# EasyEDA Pro project ProPrj_digirig-mobile_2025-02-21.epro

# Schematic digirig-mobile
Board Name: digirig-mobile; Create Date: 2025-02-21; Page Name: digirig-mobile; Project Name: digirig-mobile; Schematic Name: digirig-mobile; Update Date: 2025-02-20; File: digirig-mobile; Id: /; Sheet: /
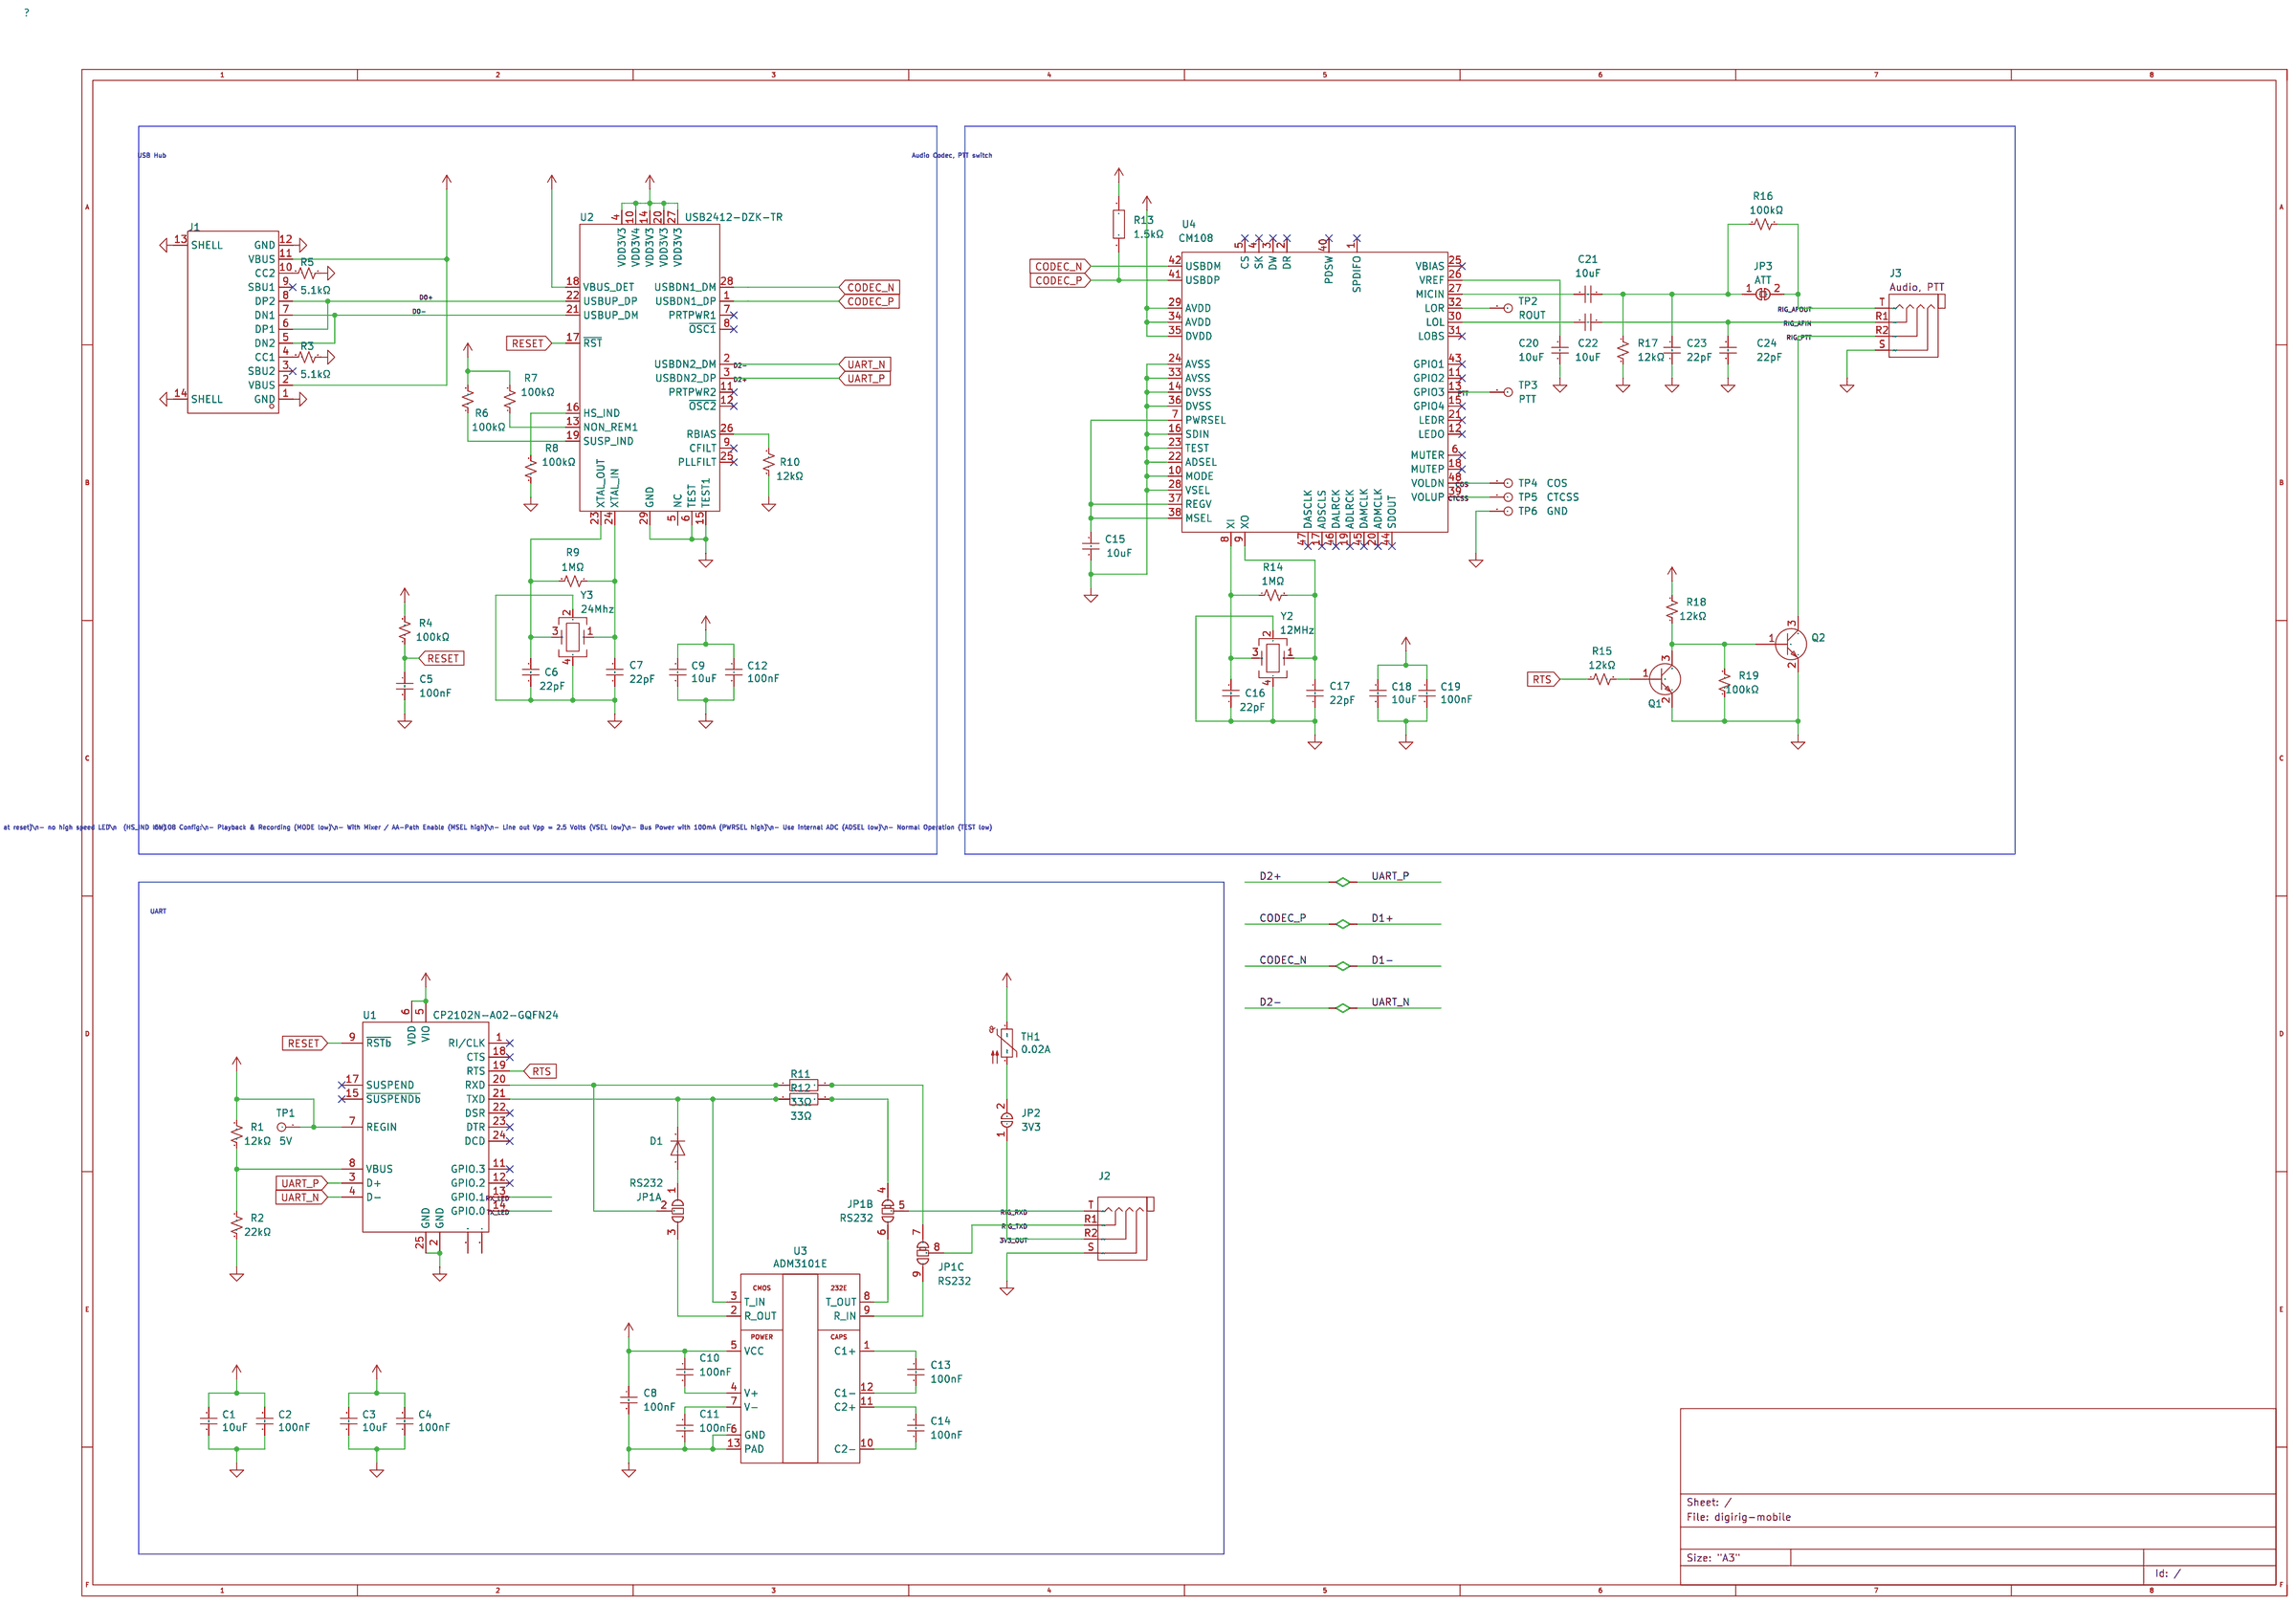
[diagram p0: schematic sheet]

## Parts
C1  10uF  [C0402]
C2  100nF  [C0402]
C3  10uF  [C0402]
C4  100nF  [C0402]
C5  100nF  [C0402]
C6  22pF  [C0402]
C7  22pF  [C0402]
C8  100nF  [C0402]
C9  10uF  [C0402]
C10  100nF  [C0402]
C11  100nF  [C0402]
C12  100nF  [C0402]
C13  100nF  [C0402]
C14  100nF  [C0402]
C15  10uF  [C0402]
C16  22pF  [C0402]
C17  22pF  [C0402]
C18  10uF  [C0402]
C19  100nF  [C0402]
C20  10uF  [C0402]
C21  10uF  [C0402]
C22  10uF  [C0402]
C23  22pF  [C0402]
C24  22pF  [C0402]
D1  1N5819WS  [SOD-323_L1.8-W1.3-LS2.5-RD]
J1  TYPE-C 16PIN 2MD(073)  [USB-C-SMD_TYPE-C-6PIN-2MD-073]
J2  PJ-320A  [footprints:TRRS-PJ-320A]
J3  PJ-320A  [footprints:TRRS-PJ-320A]
JP1  RS232  [footprints:SolderJumper9-BCu]  (sections 1,2,3)
JP2  3V3  [footprints:SolderJumper2-BCu]
JP3  ATT  [footprints:SolderJumper-BCu-Bridged]
Q1  SS8050  [SOT-23-3_L2.9-W1.3-P1.90-LS2.4-BR]
Q2  SS8050  [SOT-23-3_L2.9-W1.3-P1.90-LS2.4-BR]
R1  12kΩ  [R0402]
R2  22kΩ  [R0402]
R3  5.1kΩ  [R0402]
R4  100kΩ  [R0402]
R5  5.1kΩ  [R0402]
R6  100kΩ  [R0402]
R7  100kΩ  [R0402]
R8  100kΩ  [R0402]
R9  1MΩ  [R0402]
R10  12kΩ  [R0402]
R11  33Ω  [R0402]
R12  33Ω  [R0402]
R13  1.5kΩ  [R0402]
R14  1MΩ  [R0402]
R15  12kΩ  [R0402]
R16  100kΩ  [R0402]
R17  12kΩ  [R0402]
R18  12kΩ  [R0402]
R19  100kΩ  [R0402]
TH1  0.02A  [Resistor_SMD:R_0603_1608Metric]
TP1  5V  [footprints:TP]
TP2  ROUT  [footprints:TP]
TP3  PTT  [footprints:TP]
TP4  COS  [footprints:TP]
TP5  CTCSS  [footprints:TP]
TP6  GND  [footprints:TP]
U1  CP2102N-A02-GQFN24  [Package_DFN_QFN:QFN-24-1EP_4x4mm_P0.5mm_EP2.6x2.6mm]
U2  USB2412-DZK-TR  [Package_DFN_QFN:QFN-28-1EP_5x5mm_P0.5mm_EP3.35x3.35mm]
U3  ADM3101E  [Package_DFN_QFN:QFN-12-1EP_3x3mm_P0.51mm_EP1.45x1.45mm]
U4  CM108  [Package_QFP:LQFP-48_7x7mm_P0.5mm]
Y2  12MHz  [CRYSTAL-SMD_4P-L3.2-W2.5-BL]
Y3  24Mhz  [CRYSTAL-SMD_4P-L3.2-W2.5-BL]

## Library data of the parts
C1 C3 C9 C15 C18 C20-C22 = CL05A106MQ5NUNC: 容值:10uF;精度:±20%;额定电压:6.3V;材质(温度系数):X5R;; LCSC Part Name: 10uF ±20% 6.3V; Supplier Part: C15525; Manufacturer: SAMSUNG(三星); Supplier Footprint: 0402; JLCPCB Part Class: Basic Part; Datasheet: https://atta.szlcsc.com/upload/public/pdf/source/20220823/2B02EE04F8F211D38A52DCB16EB6BEBA.pdf; Supplier: LCSC; Tolerance: ±20%; Voltage Rated: 6.3V; Temperature Coefficient: X5R
C2 C4 C5 C8 C10-C14 C19 = CL05B104KB54PNC: 容值:100nF;精度:±10%;额定电压:50V;材质(温度系数):X7R;; LCSC Part Name: 100nF ±10% 50V; Supplier Part: C307331; Manufacturer: SAMSUNG(三星); Supplier Footprint: 0402; JLCPCB Part Class: Basic Part; Datasheet: https://atta.szlcsc.com/upload/public/pdf/source/20160218/1457707763339.pdf; Supplier: LCSC; Tolerance: ±10%; Voltage Rated: 50V; Temperature Coefficient: X7R
C6 C7 C16 C17 C23 C24 = 0402CG220J500NT: 容值:22pF;精度:±5%;额定电压:50V;材质(温度系数):C0G;; LCSC Part Name: 22pF ±5% 50V; Supplier Part: C1555; Manufacturer: FH(风华); Supplier Footprint: 0402; JLCPCB Part Class: Basic Part; Datasheet: https://atta.szlcsc.com/upload/public/pdf/source/20200305/C486355_26A10D38EF8C2A5C37091D0039909270.pdf; Supplier: LCSC; Tolerance: ±5%; Voltage Rated: 50V; Temperature Coefficient: C0G
D1 = 1N5819WS_C191023: 正向压降(Vf):600mV@1A;直流反向耐压(Vr):40V;整流电流:1A;; LCSC Part Name: 电压:40V 电流:1A; Supplier Part: C191023; Manufacturer: Hottech(合科泰); Supplier Footprint: SOD-323; JLCPCB Part Class: Basic Part; Datasheet: https://atta.szlcsc.com/upload/public/pdf/source/20220428/3CB86FD8D28D653594B4E35F9D5AEFD9.pdf; Supplier: LCSC; Forward Voltage (Vf@If): 600mV@1A; Reverse Voltage (Vr): 40V; Rectified Current: 1A
J1 = TYPE-C 16PIN 2MD(073): 连接器类型:Type-C;标准:USB 3.1;公母:母;安装方式:卧贴;触点数量:16P;端口数量:1;额定电流 - 电源:5A;工作温度范围:-25℃~+85℃;; LCSC Part Name: Type-C 母 卧贴; Supplier Part: C2765186; Manufacturer: SHOU HAN(首韩); Supplier Footprint: SMD; JLCPCB Part Class: Extended Part; Datasheet: https://atta.szlcsc.com/upload/public/pdf/source/20211123/39B17C16241EAC15C5E277BDA434118E.pdf; Supplier: LCSC; Connector Type: Type-C; Standard: USB 3.1; Gender: 母; Mounting Style: 卧贴; Number of Contacts: 16P; Number of Ports: 1; Current Rating - Power (Max): 5A; Operating Temperature Range: -25℃~+85℃; Rated Voltage (Max): 5V; Connect-Disconnect Life: 5千次; Core Colour: 黑色
J2 = Connector_AudioJack4: Label: Serial, 3V3
J3 = Connector_AudioJack4: Label: Audio, PTT
JP1 = digirig_SolderJumper_9
JP2 = Jumper_SolderJumper_2_Open
JP3 = Jumper_SolderJumper_2_Bridged
Q1 Q2 = SS8050_C7420370: 晶体管类型:NPN;集电极电流(Ic):1.5A;集射极击穿电压(Vceo):25V;功率(Pd):300mW;直流电流增益(hFE@Ic,Vce):120@100mA,1.0V;; LCSC Part Name: 耐压:25V 电流:1.5A NPN H档 200-350; Supplier Part: C7420370; Manufacturer: 宏迦橙; Supplier Footprint: SOT-23; JLCPCB Part Class: Extended Part; Datasheet: https://atta.szlcsc.com/upload/public/pdf/source/20231222/9C4050A7669EB24B3ACD0418218817FD.pdf; Supplier: LCSC; Transistor Type: NPN; Collector Current (Ic): 1.5A; Collector-Emitter Breakdown Voltage (Vceo): 25V; Power Dissipation (Pd): 300mW; DC Current Gain (hFE@Ic,Vce): 120@100mA,1.0V; Transition Frequency (fT): 100MHz; Collector Cut-Off Current (Icbo): 100nA; Collector-Emitter Saturation Voltage (VCE(sat)@Ic,Ib): 500mV@800mA,80mA; Operating Temperature: -55℃~+150℃
R1 R10 R15 R17 R18 = 0402WGF1202TCE: 电阻类型:厚膜电阻;阻值:12kΩ;精度:±1%;功率:62.5mW;最大工作电压:50V;温度系数:±100ppm/℃;; LCSC Part Name: 12kΩ ±1% 62.5mW 厚膜电阻; Supplier Part: C25752; Manufacturer: UNI-ROYAL(厚声); Supplier Footprint: 0402; JLCPCB Part Class: Basic Part; Datasheet: https://atta.szlcsc.com/upload/public/pdf/source/20200306/C422600_1E6D84923E4A46A82E41ADD87F860B5C.pdf; Supplier: LCSC; Type: 厚膜电阻; Tolerance: ±1%; Power(Watts): 62.5mW; Overload Voltage (Max): 50V; Temperature Coefficient: ±100ppm/℃; Operating Temperature Range: -55℃~+155℃
R2 = 0402WGF2202TCE: 电阻类型:厚膜电阻;阻值:22kΩ;精度:±1%;功率:62.5mW;最大工作电压:50V;温度系数:±100ppm/℃;; LCSC Part Name: 22kΩ ±1% 62.5mW 厚膜电阻; Supplier Part: C25768; Manufacturer: UNI-ROYAL(厚声); Supplier Footprint: 0402; JLCPCB Part Class: Basic Part; Datasheet: https://atta.szlcsc.com/upload/public/pdf/source/20200306/C422600_1E6D84923E4A46A82E41ADD87F860B5C.pdf; Supplier: LCSC; Type: 厚膜电阻; Tolerance: ±1%; Power(Watts): 62.5mW; Overload Voltage (Max): 50V; Temperature Coefficient: ±100ppm/℃; Operating Temperature Range: -55℃~+155℃
R3 R5 = 0402WGF5101TCE: 电阻类型:厚膜电阻;阻值:5.1kΩ;精度:±1%;功率:62.5mW;最大工作电压:50V;温度系数:±100ppm/℃;; LCSC Part Name: 5.1kΩ ±1% 62.5mW 厚膜电阻; Supplier Part: C25905; Manufacturer: UNI-ROYAL(厚声); Supplier Footprint: 0402; JLCPCB Part Class: Basic Part; Datasheet: https://atta.szlcsc.com/upload/public/pdf/source/20200306/C422600_1E6D84923E4A46A82E41ADD87F860B5C.pdf; Supplier: LCSC; Type: 厚膜电阻; Tolerance: ±1%; Power(Watts): 62.5mW; Overload Voltage (Max): 50V; Temperature Coefficient: ±100ppm/℃; Operating Temperature Range: -55℃~+155℃
R4 R6-R8 R16 R19 = 0402WGF1003TCE: 电阻类型:厚膜电阻;阻值:100kΩ;精度:±1%;功率:62.5mW;最大工作电压:50V;温度系数:±100ppm/℃;; LCSC Part Name: 100kΩ ±1% 62.5mW 厚膜电阻; Supplier Part: C25741; Manufacturer: UNI-ROYAL(厚声); Supplier Footprint: 0402; JLCPCB Part Class: Basic Part; Datasheet: https://atta.szlcsc.com/upload/public/pdf/source/20200306/C422600_1E6D84923E4A46A82E41ADD87F860B5C.pdf; Supplier: LCSC; Type: 厚膜电阻; Tolerance: ±1%; Power(Watts): 62.5mW; Overload Voltage (Max): 50V; Temperature Coefficient: ±100ppm/℃; Operating Temperature Range: -55℃~+155℃
R9 R14 = 0402WGF1004TCE: 电阻类型:厚膜电阻;阻值:1MΩ;精度:±1%;功率:62.5mW;最大工作电压:50V;温度系数:±100ppm/℃;; LCSC Part Name: 1MΩ ±1% 62.5mW 厚膜电阻; Supplier Part: C26083; Manufacturer: UNI-ROYAL(厚声); Supplier Footprint: 0402; JLCPCB Part Class: Basic Part; Datasheet: https://atta.szlcsc.com/upload/public/pdf/source/20200306/C422600_1E6D84923E4A46A82E41ADD87F860B5C.pdf; Supplier: LCSC; Type: 厚膜电阻; Tolerance: ±1%; Power(Watts): 62.5mW; Overload Voltage (Max): 50V; Temperature Coefficient: ±100ppm/℃; Operating Temperature Range: -55℃~+155℃
R11 R12 = 0402WGF330JTCE: 电阻类型:厚膜电阻;阻值:33Ω;精度:±1%;功率:62.5mW;最大工作电压:50V;温度系数:±100ppm/℃;; LCSC Part Name: 33Ω ±1% 62.5mW 厚膜电阻; Supplier Part: C25105; Manufacturer: UNI-ROYAL(厚声); Supplier Footprint: 0402; JLCPCB Part Class: Basic Part; Datasheet: https://atta.szlcsc.com/upload/public/pdf/source/20200306/C422600_1E6D84923E4A46A82E41ADD87F860B5C.pdf; Supplier: LCSC; Type: 厚膜电阻; Tolerance: ±1%; Power(Watts): 62.5mW; Overload Voltage (Max): 50V; Temperature Coefficient: ±100ppm/℃; Operating Temperature Range: -55℃~+155℃
R13 = 0402WGF1501TCE: 电阻类型:厚膜电阻;阻值:1.5kΩ;精度:±1%;功率:62.5mW;最大工作电压:50V;温度系数:±100ppm/℃;; LCSC Part Name: 1.5kΩ ±1% 62.5mW 厚膜电阻; Supplier Part: C25867; Manufacturer: UNI-ROYAL(厚声); Supplier Footprint: 0402; JLCPCB Part Class: Basic Part; Datasheet: https://atta.szlcsc.com/upload/public/pdf/source/20200306/C422600_1E6D84923E4A46A82E41ADD87F860B5C.pdf; Supplier: LCSC; Type: 厚膜电阻; Tolerance: ±1%; Power(Watts): 62.5mW; Overload Voltage (Max): 50V; Temperature Coefficient: ±100ppm/℃; Operating Temperature Range: -55℃~+155℃
TH1 = Device_Thermistor_PTC
TP1-TP6 = Connector_TestPoint
U1 = Interface_USB_CP2102N-A01-GQFN24: User doc link: https://www.silabs.com/documents/public/data-sheets/cp2102n-datasheet.pdf
U2 = digirig_USB2412-DZK-TR
U3 = digirig_ADM3101E
U4 = digirig_CM108
Y2 Y3 = X322512MSB4SI: 晶振类型:贴片晶振;频率:12MHz;常温频差:±10ppm;外接负载电容:20pF;频率稳定度(全温):±20ppm;; LCSC Part Name: 12MHz ±10ppm 20pF; Supplier Part: C9002; Manufacturer: YXC(扬兴晶振); Supplier Footprint: SMD3225-4P; JLCPCB Part Class: Basic Part; Datasheet: https://atta.szlcsc.com/upload/public/pdf/source/20240329/19D5F850207469550BEB00D7DFEDBC7A.pdf; Supplier: LCSC; Crystal Type: 贴片晶振; Normal temperature Frequency Tolerance: ±10ppm; External load capacitor: 20pF; Frequency Stability(Full temperature range): ±20ppm; Operating Temperature: -40℃~+85℃

## Nets
3V3_OUT: J2.R2 JP2.1(A)
CODEC_N: U2.28(USBDN1_DM) U4.42(USBDM)
CODEC_P: R13.2 U2.1(USBDN1_DP) U4.41(USBDP)
COS: TP4.1 U4.48(VOLDN)
CTCSS: TP5.1 U4.39(VOLUP)
D0+: J1.6(DP1) J1.8(DP2) U2.22(USBUP_DP)
D0-: J1.5(DN2) J1.7(DN1) U2.21(USBUP_DM)
D2+: U1.3(D+) U2.3(USBDN2_DP)
D2-: U1.4(D-) U2.2(USBDN2_DM)
POWER_+3V3: C3.1 C4.1 C8.1 C9.1 C10.1 C12.1 R4.2 R6.2 R7.2 R13.1 TH1.1 U1.5(VIO) U1.6(VDD) U2.4(VDD3V3) U2.10(VDD3V4) U2.14(VDD3V3) U2.18(VBUS_DET) U2.20(VDD3V3) U2.27(VDD3V3) U3.5(VCC)
POWER_+5V: C1.1 C2.1 C18.1 C19.1 J1.2(VBUS) J1.11(VBUS) R1.2 R18.2 TP1.1 U1.7(REGIN) U4.29(AVDD) U4.34(AVDD) U4.35(DVDD)
POWER_GND: C1.2 C2.2 C3.2 C4.2 C5.2 C6.2 C7.2 C8.2 C9.2 C11.2 C12.2 C15.1 C16.2 C17.2 C18.2 C19.2 C20.2 C23.2 C24.2 J1.1(GND) J1.12(GND) J1.13(SHELL) J1.14(SHELL) J2.S J3.S Q1.2(E) Q2.2(E) R2.1 R3.1 R5.1 R8.1 R10.1 R17.2 R19.1 TP6.1 U1.2(GND) U1.25(GND) U2.6(TEST) U2.15(TEST1) U2.29(GND) U3.6(GND) U3.13(PAD) U4.10(MODE) U4.14(DVSS) U4.16(SDIN) U4.22(ADSEL) U4.23(TEST) U4.24(AVSS) U4.28(VSEL) U4.33(AVSS) U4.36(DVSS) Y2.2 Y2.4 Y3.2 Y3.4
PTT: TP3.1 U4.13(GPIO3)
RESET: C5.1 R4.1 U1.9(~{RSTb}) U2.17(~{RST})
RIG_AFIN: C22.1 C24.1 J3.R1
RIG_AFOUT: J3.T JP3.2(B) R16.1
RIG_PTT: J3.R2 Q2.3(C)
RIG_RXD: J2.T JP1.5(B)
RIG_TXD: J2.R1 JP1.8(B)
RTS: R15.1 U1.19(RTS)
RX_LED: U1.13(GPIO.1)
TX_LED: U1.14(GPIO.0)
$1N2: R1.1 R2.2 U1.8(VBUS)
$1N10: C14.1 U3.11(C2+)
$1N15: C20.1 U4.26(VREF)
$1N17: JP1.6(C) U3.8(T_OUT)
$1N18: R7.1 U2.13(NON_REM1)
$1N19: C16.1 R14.1 U4.8(XI) Y2.3
$1N20: C17.1 R14.2 U4.9(XO) Y2.1
$1N22: JP1.4(A) R12.2
$1N28: JP1.9(C) U3.9(R_IN)
$1N35: C6.1 R9.2 U2.23(XTAL_OUT) Y3.3
$1N36: C21.1 C23.1 JP3.1(A) R16.2 R17.1
$1N41: JP1.2(B) R11.1 U1.20(RXD)
$1N46: C13.1 U3.1(C1+)
$1N47: Q1.3(C) Q2.1(B) R18.1 R19.2
$1N49: D1.1(K) R12.1 U1.21(TXD) U3.3(T_IN)
$1N52: C13.2 U3.12(C1-)
$1N53: C21.2 U4.27(MICIN)
$1N55: C7.1 R9.1 U2.24(XTAL_IN) Y3.1
$1N61: C22.2 U4.30(LOL)
$1N63: JP2.2(B) TH1.2
$1N69: D1.2(A) JP1.1(A)
$1N71: C11.1 U3.7(V-)
$1N73: C15.2 U4.7(PWRSEL) U4.37(REGV) U4.38(MSEL)
$1N87: JP1.3(C) U3.2(R_OUT)
$1N90: C10.2 U3.4(V+)
$1N97: R8.2 U2.16(HS_IND)
$1N110: R10.2 U2.26(RBIAS)
$1N111: TP2.1 U4.32(LOR)
$1N114: JP1.7(A) R11.2
$1N116: C14.2 U3.10(C2-)
$1N122: R6.1 U2.19(SUSP_IND)
$1N130: Q1.1(B) R15.2
$1N5736: J1.10(CC2) R5.2
$1N5738: J1.4(CC1) R3.2

Not connected (* = marked no-connect by the designer): J1 3(SBU2)* 9(SBU1)*; U1 1(RI/CLK)* 10(NC) 11(GPIO.3)* 12(GPIO.2)* 15(~{SUSPENDb})* 16(NC) 17(SUSPEND)* 18(CTS)* 22(DSR)* 23(DTR)* 24(DCD)*; U2 5(NC) 7(PRTPWR1)* 8(~{OSC1})* 9(CFILT)* 11(PRTPWR2)* 12(~{OSC2})* 25(PLLFILT)*; U4 1(SPDIFO)* 2(DR)* 3(DW)* 4(SK)* 5(CS)* 6(MUTER)* 11(GPIO2)* 12(LEDO)* 15(GPIO4)* 17(ADSCLS)* 18(MUTEP)* 19(ADLRCK)* 20(ADMCLK)* 21(LEDR)* 25(VBIAS)* 31(LOBS)* 40(PDSW)* 43(GPIO1)* 44(SDOUT)* 45(DAMCLK)* 46(DALRCK)* 47(DASCLK)*

## Notes on the sheet
- USB Hub
- Audio Codec, PTT switch
- USB1412 Config:\n- both ports are non-removable\n  (NON_REM1, SUSP_IND/NON_REM2 high at reset)\n- no high speed LED\n  (HS_IND low)
- CM108 Config:\n- Playback & Recording (MODE low)\n- With Mixer / AA-Path Enable (MSEL high)\n- Line out Vpp = 2.5 Volts (VSEL low)\n- Bus Power with 100mA (PWRSEL high)\n- Use internal ADC (ADSEL low)\n- Normal Operation (TEST low)
- UART

# Board digirig-mobile
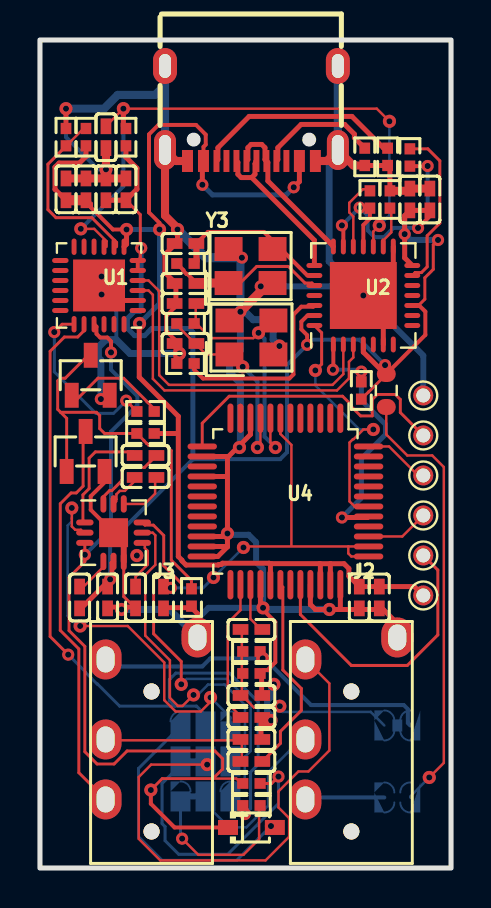
[diagram p1: board, top side]
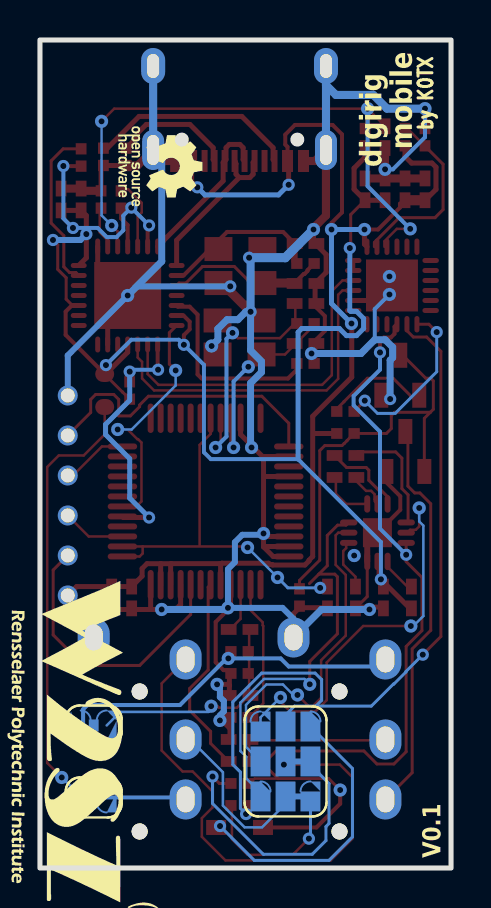
[diagram p2: board, bottom side, seen from below]

Outline 20.57 x 41.4 mm; copper layers: Top Layer, Bottom Layer. Coordinates in mm from the lower left corner of the outline.
Outline path: rectangle 0,41.4 20.57,0
Stack: Top Layer 0.0009mm / dielectric 1 0.0384mm FR4 er 4.5 / Bottom Layer 0.0009mm

## Design rules (mm)
spacing safeClearance (default): track to track 0.152, other pairs 0.152 to 0.3
track width trackWidth (default): min 0.127, default 0.254, max 2.54
differential pair differentialPair (default): width min 0.127, default 0.254, max 2.54; gap min 0.152, default 0.152
via viaSize (default): diameter min 0.5, default 0.61, max 10; hole min 0.3, default 0.305, max 6

## Placement (name value [footprint] x y rotation side)
C1  10uF  [C0402]  1.3 33.94 90 top
C2  100nF  [C0402]  2.3 33.94 90 top
C3  10uF  [C0402]  19.51 33.43 90 top
C4  100nF  [C0402]  18.51 33.43 90 top
C5  100nF  [C0402]  3.3 36.54 270 top
C6  22pF  [C0402]  7.28 31.23 180 top
C7  22pF  [C0402]  7.28 29.23 180 top
C8  100nF  [C0402]  3.38 13.53 270 top
C9  10uF  [C0402]  4.3 33.94 90 top
C10  100nF  [C0402]  1.98 13.53 90 top
C11  100nF  [C0402]  4.78 13.53 270 top
C12  100nF  [C0402]  3.3 33.94 90 top
C13  100nF  [C0402]  5.28 20.63 0 top
C14  100nF  [C0402]  5.28 19.53 0 top
C15  10uF  [C0402]  6.18 13.53 90 top
C16  22pF  [C0402]  7.28 28.23 180 top
C17  22pF  [C0402]  7.28 26.23 180 top
C18  10uF  [C0402]  15.98 13.53 270 top
C19  100nF  [C0402]  16.98 13.53 270 top
C20  10uF  [C0402]  10.58 7.53 0 top
C21  10uF  [C0402]  10.58 11.93 0 top
C22  10uF  [C0402]  10.58 5.33 0 top
C23  22pF  [C0402]  10.58 8.63 0 top
C24  22pF  [C0402]  10.58 6.43 0 top
D1  1N5819WS  [SOD-323_L1.8-W1.3-LS2.5-RD]  10.58 2.03 0 top
J1  TYPE-C 16PIN 2MD(073)  [USB-C-SMD_TYPE-C-6PIN-2MD-073]  10.58 37.73 180 top
J2  PJ-320A  [footprints:TRRS-PJ-320A]  15.58 0.23 180 top
J3  PJ-320A  [footprints:TRRS-PJ-320A]  5.58 0.23 180 top
JP1  RS232  [footprints:SolderJumper9-BCu]  8.28 5.33 180 bottom
JP2  3V3  [footprints:SolderJumper2-BCu]  17.88 3.53 180 bottom
JP3  ATT  [footprints:SolderJumper-BCu-Bridged]  17.88 7.13 180 bottom
Q1  SS8050  [SOT-23-3_L2.9-W1.3-P1.90-LS2.4-BR]  2.54 24.64 270 top
Q2  SS8050  [SOT-23-3_L2.9-W1.3-P1.90-LS2.4-BR]  2.29 20.83 270 top
R1  12kΩ  [R0402]  2.3 36.54 270 top
R2  22kΩ  [R0402]  1.3 36.54 270 top
R3  5.1kΩ  [R0402]  16.26 35.56 90 top
R4  100kΩ  [R0402]  4.3 36.54 270 top
R5  5.1kΩ  [R0402]  17.4 35.56 90 top
R6  100kΩ  [R0402]  16.51 33.43 270 top
R7  100kΩ  [R0402]  18.51 35.53 270 top
R8  100kΩ  [R0402]  17.51 33.43 270 top
R9  1MΩ  [R0402]  7.28 30.23 0 top
R10  12kΩ  [R0402]  7.28 25.23 0 top
R11  33Ω  [R0402]  10.58 3.13 0 top
R12  33Ω  [R0402]  10.58 4.23 0 top
R13  1.5kΩ  [R0402]  16.08 23.88 90 top
R14  1MΩ  [R0402]  7.28 27.23 180 top
R15  12kΩ  [R0402]  5.28 22.83 0 top
R16  100kΩ  [R0402]  10.58 10.83 180 top
R17  12kΩ  [R0402]  10.58 9.73 0 top
R18  12kΩ  [R0402]  5.28 21.73 0 top
R19  100kΩ  [R0402]  7.58 13.53 90 top
TH1  0.02A  [Resistor_SMD:R_0603_1608Metric]  17.33 23.88 270 top
TP1  5V  [footprints:TP]  19.18 13.63 0 top
TP2  ROUT  [footprints:TP]  19.18 15.63 0 top
TP3  PTT  [footprints:TP]  19.18 21.63 0 top
TP4  COS  [footprints:TP]  19.18 19.63 0 top
TP5  CTCSS  [footprints:TP]  19.18 17.63 0 top
TP6  GND  [footprints:TP]  19.18 23.63 0 top
U1  CP2102N-A02-GQFN24  [Package_DFN_QFN:QFN-24-1EP_4x4mm_P0.5mm_EP2.6x2.6mm]  2.96 29.13 180 top
U2  USB2412-DZK-TR  [Package_DFN_QFN:QFN-28-1EP_5x5mm_P0.5mm_EP3.35x3.35mm]  16.18 28.63 90 top
U3  ADM3101E  [Package_DFN_QFN:QFN-12-1EP_3x3mm_P0.51mm_EP1.45x1.45mm]  3.68 16.77 0 top
U4  CM108  [Package_QFP:LQFP-48_7x7mm_P0.5mm]  12.28 18.33 270 top
Y2  12MHz  [CRYSTAL-SMD_4P-L3.2-W2.5-BL]  10.58 26.53 0 top
Y3  24Mhz  [CRYSTAL-SMD_4P-L3.2-W2.5-BL]  10.54 30.1 0 top

## Footprints (pads in the part's own frame, mm; a bottom-side part is the same pattern mirrored in y, then rotated)
C0402
  rect 0.79x0.54 smd: 1(-0.545,0) 2(0.545,0)
CRYSTAL-SMD_4P-L3.2-W2.5-BL
  rect 1.4x1.2 smd: 1(-1.1,-0.85) 2(1.1,-0.85) 3(1.1,0.85) 4(-1.1,0.85)
footprints:SolderJumper2-BCu
  custom 1x1.5 smd: 1(0.65,0) 2(-0.65,0)
footprints:SolderJumper9-BCu
  custom 1x1.5 smd: 1(1.25,1.75) 3(-1.25,1.75) 7(1.25,-1.75) 9(-1.25,-1.75)
  rect 1x1.5 smd: 2(0,1.75) 4(1.25,0) 5(0,0) 6(-1.25,0) 8(0,-1.75)
footprints:SolderJumper-BCu-Bridged
  custom 1x1.5 smd: 1(0.65,0) 2(-0.65,0)
footprints:TP
  round 1 hole 0.7: 1(0,0)
footprints:TRRS-PJ-320A
  round 0.8 hole 0.8: (0,-1.6) (0,-8.6)
  oval 1.6x2 hole 0.9x1.3: R1(2.3,-6.2) R2(2.3,-3.2) S(-2.3,-11.3) T(2.3,-10.2)
Package_DFN_QFN:QFN-12-1EP_3x3mm_P0.51mm_EP1.45x1.45mm
  rrect 0.875x0.3 smd: 1(-1.438,0.51) 2(-1.438,0) 3(-1.438,-0.51) 7(1.438,-0.51) 8(1.438,0) 9(1.438,0.51)
  rrect 0.3x0.875 smd: 4(-0.51,-1.438) 5(0,-1.438) 6(0.51,-1.438) 10(0.51,1.438) 11(0,1.438) 12(-0.51,1.438)
  rect 1.45x1.45 smd: 13(0,0)
Package_DFN_QFN:QFN-24-1EP_4x4mm_P0.5mm_EP2.6x2.6mm
  rrect 0.825x0.25 smd: 1(-1.938,1.25) 2(-1.938,0.75) 3(-1.938,0.25) 4(-1.938,-0.25) 5(-1.938,-0.75) 6(-1.938,-1.25) 13(1.938,-1.25) 14(1.938,-0.75) 15(1.938,-0.25) 16(1.938,0.25) 17(1.938,0.75) 18(1.938,1.25)
  rrect 0.25x0.825 smd: 7(-1.25,-1.938) 8(-0.75,-1.938) 9(-0.25,-1.938) 10(0.25,-1.938) 11(0.75,-1.938) 12(1.25,-1.938) 19(1.25,1.938) 20(0.75,1.938) 21(0.25,1.938) 22(-0.25,1.938) 23(-0.75,1.938) 24(-1.25,1.938)
  rect 2.6x2.6 smd: 25(0,0)
Package_DFN_QFN:QFN-28-1EP_5x5mm_P0.5mm_EP3.35x3.35mm
  rrect 0.8x0.25 smd: 1(-2.45,1.5) 2(-2.45,1) 3(-2.45,0.5) 4(-2.45,0) 5(-2.45,-0.5) 6(-2.45,-1) 7(-2.45,-1.5) 15(2.45,-1.5) 16(2.45,-1) 17(2.45,-0.5) 18(2.45,0) 19(2.45,0.5) 20(2.45,1) 21(2.45,1.5)
  rrect 0.25x0.8 smd: 8(-1.5,-2.45) 9(-1,-2.45) 10(-0.5,-2.45) 11(0,-2.45) 12(0.5,-2.45) 13(1,-2.45) 14(1.5,-2.45) 22(1.5,2.45) 23(1,2.45) 24(0.5,2.45) 25(0,2.45) 26(-0.5,2.45) 27(-1,2.45) 28(-1.5,2.45)
  rect 3.35x3.35 smd: 29(0,0)
Package_QFP:LQFP-48_7x7mm_P0.5mm
  rrect 1.475x0.3 smd: 1(-4.162,2.75) 2(-4.162,2.25) 3(-4.162,1.75) 4(-4.162,1.25) 5(-4.162,0.75) 6(-4.162,0.25) 7(-4.162,-0.25) 8(-4.162,-0.75) 9(-4.162,-1.25) 10(-4.162,-1.75) 11(-4.162,-2.25) 12(-4.162,-2.75) 25(4.162,-2.75) 26(4.162,-2.25) 27(4.162,-1.75) 28(4.162,-1.25) 29(4.162,-0.75) 30(4.162,-0.25) 31(4.162,0.25) 32(4.162,0.75) 33(4.162,1.25) 34(4.162,1.75) 35(4.162,2.25) 36(4.162,2.75)
  rrect 0.3x1.475 smd: 13(-2.75,-4.162) 14(-2.25,-4.162) 15(-1.75,-4.162) 16(-1.25,-4.162) 17(-0.75,-4.162) 18(-0.25,-4.162) 19(0.25,-4.162) 20(0.75,-4.162) 21(1.25,-4.162) 22(1.75,-4.162) 23(2.25,-4.162) 24(2.75,-4.162) 37(2.75,4.162) 38(2.25,4.162) 39(1.75,4.162) 40(1.25,4.162) 41(0.75,4.162) 42(0.25,4.162) 43(-0.25,4.162) 44(-0.75,4.162) 45(-1.25,4.162) 46(-1.75,4.162) 47(-2.25,4.162) 48(-2.75,4.162)
R0402
  rect 0.566x0.54 smd: 1(-0.433,0) 2(0.433,0)
Resistor_SMD:R_0603_1608Metric
  rrect 0.8x0.95 smd: 1(-0.825,0) 2(0.825,0)
SOD-323_L1.8-W1.3-LS2.5-RD
  rect 1x0.75 smd: 1(-1.173,0) 2(1.173,0)
SOT-23-3_L2.9-W1.3-P1.90-LS2.4-BR
  rect 1.25x0.7 smd: 1(1,-0.95) 2(1,0.95) 3(-1,0)
USB-C-SMD_TYPE-C-6PIN-2MD-073
  rect 0.55x1.1 smd: 1(-3.2,2.375) 2(-2.4,2.375) 11(2.4,2.375) 12(3.2,2.375)
  rect 0.3x1.1 smd: 3(-1.75,2.375) 4(-1.25,2.375) 5(-0.75,2.375) 6(-0.25,2.375) 7(0.25,2.375) 8(0.75,2.375) 9(1.25,2.375) 10(1.75,2.375)
  oval 1.1x2 hole 0.6x1.5: 13(-4.325,1.825) 14(4.325,1.825)
  oval 1.2x1.8 hole 0.6x1.2: 13(-4.325,-2.375) 14(4.325,-2.375)

## Nets
As in the schematic.

Pads without a net: J1 3 9; U1 1 10 11 12 15 16 17 18 22 23 24; U2 5 7 8 9 11 12 25; U4 1 2 3 4 5 6 11 12 15 17 18 19 20 21 25 31 40 43 44 45 46 47

## Via types
v1: diameter 0.66, hole 0.3, Top Layer to Bottom Layer, 41 vias
v2: diameter 0.61, hole 0.305, Top Layer to Bottom Layer, 29 vias

## Routing (per net, layer and track width the routed paths; a pad name or vN(x,y) marks a point on that pad's centre or on a via; arc(x,y) is an arc through that point)
3V3_OUT: length 4
  Bottom Layer w0.2: J2.R2 13.38,3.53 JP2.1
(no net):
  vias: v1(4.85,15.62)
CODEC_N: length 12.6
  Top Layer w0.127: v1(16.68,21.93) 16.18,21.93 15.7,21.44 15.66,21.44 15.49,21.27 15.49,18.33 15.75,18.08 U4.42
  Top Layer w0.152: U2.28 14.1,26.76 14.1,25.19 v1(13.78,24.88)
  Bottom Layer w0.127: v1(13.78,24.88) 13.78,24.13 15.98,21.93 v1(16.68,21.93)
CODEC_P: length 12.8
  Top Layer w0.199: U2.1 14.68,24.94 v2(14.66,24.92)
  Top Layer w0.25: v2(15.11,17.53) 16.4,17.53 U4.41
  Bottom Layer w0.199: v2(16.08,24.82) 15.99,24.92 v2(14.66,24.92)
  Bottom Layer w0.25: v2(16.08,24.82) 16.08,23.39 17.29,22.18 17.29,21.68 16.08,20.47 16.08,18.5 v2(15.11,17.53)
COS: length 3.3
  Top Layer w0.127: TP4.1 18.92,19.63 17.47,21.08 U4.48
CTCSS: length 3.2
  Top Layer w0.127: TP5.1 18.13,16.58 U4.39
D0+: length 8.1
  Top Layer w0.25: 10.6,34.52 13.73,31.39 U2.22 ; 10.6,34.52 10.07,34.52 9.91,34.69 9.91,35.28 J1.8 ; 10.6,34.52 10.76,34.69 10.76,35.21 10.81,35.26 10.81,35.33 J1.6
D0-: length 8
  Top Layer w0.25: U2.21 11.41,34.35 11.41,35.28 J1.5 11.26,35.42 11.26,36.02 11.1,36.18 10.57,36.18 10.41,36.02 10.41,35.42 J1.7
D2+: length 17
  Top Layer w0.127: 5.02,28.88 5.43,28.88 5.65,28.66 5.65,24.46 6.23,23.88 14.86,23.88 15.46,24.48 15.46,25.31 15.68,25.53 U2.3
D2-: length 16.5
  Top Layer w0.127: 5.02,29.38 5.43,29.38 5.97,28.84 5.97,24.64 6.45,24.16 14.64,24.16 15.18,24.7 U2.2
POWER_+3V3: length 82.9
  Top Layer w0.148: R13.1 16.44,23.8 16.45,23.8 17.33,24.69 TH1.1
  Top Layer w0.152: v2(19.92,31.4) 19.69,31.16 19.69,29.94 19.26,29.51 19.26,28.44 18.95,28.13 ; U1.6 5.02,30.5 5.02,32.67 C9.1
  Top Layer w0.199: v2(15.11,32.13) 15.18,32.06 U2.20 ; C3.1 19.51,32.6 v2(18.92,32) ; U2.27 13.39,27.63 13.08,27.32 13.08,26.93 13.37,26.65 v2(13.37,26.16) ; U1.5 U1.6 ; v2(16,33.02) 16.49,33.02 R6.2 16.51,32.48 16.18,32.15 U2.18 ; 18.51,35.09 19.4,35.09 v2(19.4,35.1)
  Top Layer w0.203: U2.10 18.98,28.13 19.29,27.82 19.29,26.66 TH1.1
  Top Layer w0.25: 1.98,13.05 2.12,13.05 v2(3.51,14.43) 3.6,14.52 3.6,15.25 U3.5
  Top Layer w0.254: U2.4 16.18,25.79 17.28,24.7 TH1.1 ; C3.1 C4.1 18.25,32.62 v2(18.25,31.7) 18.25,30.51 U2.14 ; R4.2 4.3,35.54 4.85,34.99 4.85,33.94 C9.1 C12.1
  Bottom Layer w0.199: v2(17.27,25.15) 16,26.42 13.63,26.42 v2(13.37,26.16) 12.37,25.16 12.37,20.79 12.03,20.45 7.65,20.45 3.51,16.3 v2(3.51,14.43) ; v2(15.11,32.13) v2(16,33.02) 16.4,32.62 16.4,31.89 16.74,31.55 17.23,31.55 17.68,32 v2(18.92,32) 19.4,32.48 v2(19.4,35.1)
  Bottom Layer w0.25: v2(5.07,31) 5.07,27.88 5.02,27.83 4.73,27.83 4.38,27.48 4.38,26.98 4.73,26.62 5.24,26.62 5.59,26.98 7.47,26.98 7.65,26.79 7.65,20.45
  Bottom Layer w0.305: v2(18.25,31.7) 18.55,31.4 v2(19.92,31.4)
POWER_+5V: length 62.7
  Top Layer w0.199: 2.56,33.23 2.56,33.02 3.65,31.93 v1(4.33,31.93) ; v1(5.98,31.93) 5.98,32.25 5.46,32.78 5.46,36.68 5.93,37.15 7.81,37.15 8.3,36.67 8.3,36.17 8.18,36.06 J1.11 ; C2.1 2.3,33.23
  Top Layer w0.25: J1.2 12.98,34.32 v2(12.7,34.04) ; 14.53,15.22 15.22,15.22 15.46,14.97 15.46,14.59 C18.1 C19.1 18.74,14.07 TP1.1 ; 14.53,15.22 14.03,15.22 14.03,15.18 ; 14.53,15.22 U4.35 ; v2(8.13,34.16) 8.13,35.3 J1.11 ; 14.03,15.18 13.99,15.22 11.58,15.22 11.53,15.18 ; 14.03,15.18 U4.34 ; v1(4.98,27.23) 4.97,27.21 4.97,24.54 6.92,22.59 6.92,15.58 7.11,15.39 7.11,15.36 7.31,15.15 8.93,15.15 8.96,15.17 9.07,15.17 9.13,15.24 11.47,15.24 11.53,15.18 ; 5.79,21.73 6.88,21.73 ; U1.7 4.33,31.19 v1(4.33,31.93) ; 11.53,15.18 U4.29
  Top Layer w0.254: 1.3,33.39 0.75,33.93 0.75,35.04 0.96,35.25 1.97,35.25 2.3,35.58 R1.2
  Top Layer w0.508: C1.1 C2.1
  Bottom Layer w0.25: v1(4.98,27.23) 5.98,28.23 v1(5.98,31.93) v1(4.33,31.93) ; v2(12.7,34.04) 12.32,33.66 8.64,33.66 v2(8.13,34.16)
POWER_GND: length 162.2
  Top Layer w0.152: 4.78,12.98 4.19,13.57 U3.6
  Top Layer w0.199: C17.2 6.74,26.43 6.32,26.85 6.32,27.6 6.74,28.02 C16.2 ; U3.13 2.54,17.91 2.54,18.59 3.36,19.41 3.36,19.96
  Top Layer w0.203: R17.2 11.18,9.89 11.39,9.89 11.78,10.28 11.78,12.3 11.17,12.92 v1(11.17,13.01)
  Top Layer w0.25: 11.06,6.98 11.47,7.38 v1(11.57,7.38) ; 11.06,6.98 11.06,6.43 ; 11.06,6.98 11.06,7.53 ; v1(11.71,9.18) 11.15,9.18 11.09,9.13 ; U4.28 11.03,13.14 v1(11.17,13.01) ; 3.08,28.73 3.48,28.73 3.83,28.38 5.02,28.38 ; 3.38,13.05 4.72,13.05 ; v1(9.38,16.73) 9.38,20.53 9.43,20.58 ; v1(9.38,16.73) 9.38,16.06 ; v1(9.38,16.73) 9.23,16.58 U4.22 ; U2.15 17.68,30.13 v1(16.18,28.63) 17.18,27.63 U2.6 ; v1(1.3,37.97) 1.3,37.05 ; J3.S 7.88,12.72 7.58,13.02 6.21,13.02 6.18,13.05 ; 6.8,28.23 6.8,29.23 6.25,29.78 6.25,30.68 6.88,31.31 v1(6.88,31.93) ; 11.09,9.13 11.08,9.13 ; 11.09,9.13 11.09,8.66 11.06,8.63 ; 11.09,9.13 11.09,9.73 ; U4.14 9.43,20.58 ; 9.43,20.58 10.53,21.68 U4.10 ; J2.S 17.88,12.23 17.18,12.93 v1(14.48,12.93) 13.78,12.93 13.53,13.18 U4.33 ; U4.36 15.03,12.98 ; v1(3.3,34.94) C12.2 ; R3.1 R5.1 17.51,35.01 R8.1 ; 9.38,16.06 8.9,15.58 U4.24 ; 9.38,16.06 9.37,16.08 U4.23 ; 6.77,25.23 6.8,25.26 6.8,26.23 ; U4.16 9.33,19.58
  Top Layer w0.301: U3.13 4.19,16.26 U3.6
  Top Layer w0.351: Q1.2 3.3,23.45 v2(3.05,23.45)
  Top Layer w0.403: R3.1 15.68,35.13 J1.13
  Top Layer w0.406: v1(6.88,31.93) 6.92,31.96 6.26,32.62 J1.14 6.81,35.35 J1.12 ; C3.2 C4.2 18.4,33.86 R8.1 ; J1.13 14.36,35.35 J1.1 ; v1(3.3,34.94) C5.2 ; C1.2 C2.2 C12.2 C9.2
  Top Layer w0.457: 11.77,29.25 11.47,29.25 v2(10.03,27.81)
  Bottom Layer w0.199: 3.82,26.41 3.82,27.94 v1(3.08,28.68)
  Bottom Layer w0.203: v1(1.3,37.97) 1.3,36.54 2.91,34.94 v1(3.3,34.94)
  Bottom Layer w0.301: TP6.1 19.18,25.63 v1(16.18,28.63) ; J3.S 7.88,12.46 8.44,13.01 v1(11.17,13.01) 11.17,14.95 10.82,15.29 10.82,16.29 10.45,16.66 9.45,16.66 v1(9.38,16.73) ; 15.73,29.08 v2(11.05,29.08)
  Bottom Layer w0.305: v1(11.71,9.18) 11.57,9.04 11.57,8.55 11.37,8.35 11.37,7.83 11.57,7.63 v1(11.57,7.38)
  Bottom Layer w0.351: v1(9.98,21.03) 10.03,21.08 10.03,24.24 9.49,24.79 9.49,25.33 10.03,25.88 v2(10.03,27.81) 10.27,27.81 10.67,27.42 11.21,27.42 11.67,26.96 11.67,26.41 v1(11.98,26.1) ; v1(4.08,12.93) 6.48,12.93 J3.S ; v2(3.05,23.45) 3.05,25.39 2.92,25.52 2.92,26.04 3.29,26.41 3.82,26.41 4.51,25.73 v1(6.98,25.73) ; v1(11.17,13.01) 11.25,12.93 v1(14.48,12.93) ; J1.13 14.48,35.47 14.48,30.33 v1(16.18,28.63)
  Bottom Layer w0.406: v2(10.03,27.81) 10.03,30.44 v2(10.11,30.52) ; J1.13 J1.13 ; J1.14 6.26,39.15 ; 6.26,39.15 5.76,38.66 3.89,38.66 3.21,37.97 v1(1.3,37.97) ; 6.26,39.15 J1.14
  Bottom Layer w0.457: v1(6.88,31.93) 8.3,30.52 v2(10.11,30.52)
  vias: v1(3.08,29.58)
PTT: length 15.4
  Top Layer w0.148: TP3.1 18.04,22.78 18.04,23.43 17.79,23.68 16.88,23.68 16.63,23.43 16.63,22.61 16.05,22.61 15.59,23.07 15.59,23.15 15.15,23.59 9.47,23.59 8.12,22.24 U4.13
RESET: length 31.2
  Top Layer w0.127: 3.33,31.06 3.33,31.34 2.71,31.96 v1(2.04,31.96) ; 3.3,37.02 3.3,37.1 v1(4.18,37.97) 16.86,37.97 v1(17.49,37.34) ; U2.17 16.68,31.83 v1(16.98,32.13)
  Top Layer w0.254: R4.1 4.18,37.1 v1(4.18,37.97)
  Bottom Layer w0.127: v1(17.49,37.34) 17.49,32.63 v1(16.98,32.13)
  Bottom Layer w0.203: v1(2.04,31.96) 4.18,34.09 v1(4.18,37.97)
RIG_AFIN: length 8
  Top Layer w0.127: 10.1,5.33 10.1,6.43 10.06,6.38 3.33,6.38 J3.R1
RIG_AFOUT: length 17.7
  Top Layer w0.127: v1(11.15,10.48) 11.09,10.53 11.09,10.83
  Bottom Layer w0.203: J3.T 3.64,10.07 8.12,10.07 8.53,10.48 v1(11.15,10.48) 11.24,10.48 13.57,8.15 18.2,8.15 18.42,7.94 18.42,7.25 JP3.2
RIG_PTT: length 20
  Top Layer w0.148: J3.R2 1.95,4.77 1.95,10.95 1.02,11.88 1.02,18.21 1.56,18.75 1.82,18.75 2.16,19.09 2.16,21.7 Q2.3
RIG_RXD: length 26.2
  Top Layer w0.127: v1(8.37,5.17) 5.56,5.17 4.95,4.55 4.95,1.46 6.02,0.38 11.29,0.38 12.47,1.56 12.47,2.49 11.94,3.03 11.94,3.83 12.93,4.83 13.43,4.83 14.48,5.88 14.48,9.23 J2.T
RIG_TXD: length 8.7
  Bottom Layer w0.127: J2.R1 13.06,6.43 11.42,4.79 11.42,3.12 10.33,2.03 9.46,2.03 8.28,3.21 JP1.8
RTS: length 8.6
  Top Layer w0.148: U1.19 1.11,27.19 v2(0.72,26.8) ; R15.1 4.32,23.36 v2(4.32,23.37)
  Bottom Layer w0.148: v2(4.32,23.37) 3.68,22.73 2.79,22.73 0.72,24.81 v2(0.72,26.8)
$1N2: length 9.3
  Top Layer w0.127: 2.28,37.07 1.31,36.1
  Top Layer w0.152: 3.83,31.06 3.83,31.28 2.6,32.52 0.8,32.52 0.4,32.92 0.4,35.19 1.3,36.1 R2.2
$1N10: length 1.9
  Top Layer w0.127: U3.11 3.81,18.33 3.81,18.42 3.83,18.43 3.83,18.69 4,18.86 4.25,18.86 4.8,19.41 4.8,19.53
$1N15: length 7.2
  Top Layer w0.127: U4.26 10.03,12.89 9.43,12.29 9.43,12.13 9.4,12.1 9.4,8.23 10.1,7.53
$1N17: length 17.5
  Top Layer w0.127: v1(7.69,8.65) 7.14,8.11 6.9,8.11 6.5,8.51 6.5,10.39 5.27,11.62 5.27,14.65 5.78,15.16 5.78,16.64 5.64,16.77 U3.8
  Bottom Layer w0.127: v1(7.69,8.65) 7.89,8.65 8.41,9.17 9.24,9.17 10.26,8.15 10.26,6.05 JP1.6
$1N18: length 8.2
  Top Layer w0.152: U2.13 18.78,29.77 18.78,29.77 19.09,29.77 19.38,30.06 19.38,31.61 20.01,32.25 20.01,35.36 19.41,35.96 R7.1
$1N19: length 13.2
  Top Layer w0.127: Y2.3 11.07,26.76 v1(10.94,26.76) 10.67,26.49 8.56,26.49 7.79,27.26 7.79,28.2 7.76,28.23 ; U4.8 11.53,21.28 v1(11.78,21.03)
  Bottom Layer w0.203: v1(10.94,26.76) 11.24,26.46 11.24,21.57 v1(11.78,21.03)
$1N20: length 10.1
  Top Layer w0.127: U4.9 11.03,21.18 v1(10.88,21.03) ; 6.77,27.23 6.77,27.22 8.31,25.68 Y2.1 10.1,25.06 v1(10.15,25.06)
  Bottom Layer w0.203: v1(10.15,25.06) 10.88,24.32 v1(10.88,21.03)
$1N22: length 13.8
  Top Layer w0.152: v2(11.94,4.57) 11.59,4.23 R12.2
  Bottom Layer w0.152: v2(11.94,4.57) 11.94,3.23 9.4,0.69 6.94,0.69 6.26,1.37 6.26,2.07 6.11,2.22 6.11,4.22 7.03,5.15 JP1.4
$1N28: length 20.2
  Top Layer w0.148: U3.9 5.25,17.14 5.68,17.14 6.19,16.63 6.19,15.12 6.62,14.69 ; 6.62,14.69 5.82,14.69 5.69,14.56 5.69,11.71 7.07,10.33 v1(7.07,9.19) ; 6.62,14.69 7.09,14.22
  Bottom Layer w0.127: JP1.9 9.78,3.82 9.78,4.02 10.25,4.49 10.25,5.56 10.54,5.85 10.54,8.27 9.36,9.45 7.34,9.45 v1(7.07,9.19)
$1N35: length 8.1
  Top Layer w0.203: C6.1 8.41,31.8 11.21,31.8 13.39,29.63 U2.23
  Top Layer w0.305: R9.2 7.83,30.34 C6.1
$1N36: length 11.2
  Top Layer w0.127: v1(12.01,8.09) 11.69,8.09 11.61,8.01 10.72,8.01 10.1,8.63 10.1,11.93
  Bottom Layer w0.127: JP3.1 16.56,7.81 12.13,7.81 12.01,7.93 v1(12.01,8.09)
$1N41: length 39.2
  Top Layer w0.148: U1.20 2.21,26.87 1.89,26.55 1.22,26.55 0.51,25.84 0.51,11.57 v2(1.41,10.67)
  Bottom Layer w0.148: 6.76,8.09 3.99,8.09 2.88,9.2 2.86,9.2 2.26,9.8 2.26,9.82 v2(1.41,10.67)
  Bottom Layer w0.152: v2(10.26,2.7) 10.54,2.98 10.54,4.8 10.92,5.18 10.92,8.3 9.48,9.74 6.8,9.74 6.48,9.42 6.48,8.38 6.76,8.09 7.83,8.09 8.28,7.64 JP1.2
$1N46: length 5.9
  Top Layer w0.148: U3.1 2.15,17.37 2.15,18.66 2.46,18.97 2.46,20.49 2.77,20.81 4.67,20.81 4.74,20.73 C13.1
$1N47: length 20.8
  Top Layer w0.148: Q2.1 1.34,22.49 1.03,22.79 ; 1.03,22.79 2.83,22.79 2.99,22.62 2.99,21.97 3.24,21.73 R18.1 5.21,21.37 5.21,21.36 5.34,21.23 5.35,21.23 5.45,21.12 6.32,21.12 6.57,20.87 6.57,15.39 7.58,14.38 R19.2 ; 1.03,22.79 0.89,22.94 0.89,24.36 1.02,24.49 1.26,24.49 2.41,25.64
$1N49: length 43.5
  Top Layer w0.127: 10.07,4.23 9.83,4.47 8.66,4.47
  Top Layer w0.148: U3.3 v2(2.25,15.66) 2.25,15.32 1.46,14.53 1.46,11.87 2.25,11.08 2.25,5.81 2.86,5.2 3.71,5.2 4.36,5.85 8.75,5.85 9.14,5.46 9.14,4.95 8.66,4.47 6.12,4.47 v1(5.55,3.9)
  Top Layer w0.199: v2(3.56,25.78) 3.56,26.34 3.37,26.53 3.01,26.53 2.83,26.71 2.83,27.07 U1.21
  Top Layer w0.203: v1(5.55,3.9) 5.55,3.21 6.74,2.03 D1.1
  Bottom Layer w0.199: v2(2.25,15.66) 3.56,16.97 3.56,21.82 4.88,23.14 4.88,23.6 3.56,24.92 v2(3.56,25.78)
$1N52: length 4.2
  Top Layer w0.152: U3.12 3.17,18.56 3.48,18.87 3.6,18.87 4.12,19.39 4.12,19.89 4.25,20.03 5.23,20.03 C13.2
$1N53: length 2.5
  Top Layer w0.127: 11.06,11.93 10.53,12.46 U4.27
$1N55: length 8.1
  Top Layer w0.152: 9.57,29.25 10.02,29.25 10.85,30.08 12.44,30.08 13.26,29.25 13.61,29.25 U2.24
  Top Layer w0.199: C7.1 7.83,29.25 7.37,29.71 7.33,29.71 7.18,29.85 7.18,29.9 R9.1
  Top Layer w0.457: 9.57,29.25 Y3.1 7.85,29.25
$1N61: length 10.1
  Top Layer w0.152: U4.30 12.16,14.04 12.16,9.9 13.08,8.98 13.08,7.88 12.03,6.83 12.03,6.23 C22.2
$1N63: length 22.1
  Top Layer w0.127: v1(19.48,4.53) 20.21,5.25 20.21,20.05 19.63,20.63 18.38,20.63 17.33,21.68 TH1.2
  Bottom Layer w0.127: JP2.2 18.53,3.58 v1(19.48,4.53)
$1N69: length 14.2
  Bottom Layer w0.152: v2(11.56,2.1) 9.85,0.38 6.11,0.38 4.93,1.56 4.93,4.98 JP1.1
$1N71: length 2.6
  Top Layer w0.127: 4.78,14.01 4.78,14.56 5.39,15.17 5.39,15.85 5.25,16 5.25,16.13 U3.7
$1N73: length 18.8
  Top Layer w0.127: U4.38 15.43,16.08 ; 15.43,16.08 15.43,15.73 15.58,15.58 U4.37 ; 15.43,16.08 10.23,16.08 v1(10.18,16.03) ; U4.7 12.03,21.71 12.58,21.16 12.58,16.13
  Bottom Layer w0.127: v1(8.68,14.53) v1(10.18,16.03)
  Bottom Layer w0.148: v1(8.68,14.53) 8.16,14.01 v2(6.55,14.01)
$1N87: length 19.7
  Top Layer w0.127: v1(8.54,8.53) 8.54,8.32 8.05,7.83 6.79,7.83 6.22,8.39 6.22,10.27 4.4,12.1 v1(2.01,12.1) ; v1(1.59,18) 1.59,17.47 ; 1.59,17.47 1.59,17.08 1.76,16.91 2.05,16.91 2.19,16.77 U3.2
  Bottom Layer w0.127: v1(1.59,18) 1.59,17.33 1.38,17.12 1.38,12.6 1.89,12.1 v1(2.01,12.1) ; v1(8.54,8.53) 9.53,7.53 JP1.3
$1N90: length 1.9
  Top Layer w0.127: 1.98,14.01 2.12,14.01 3.17,15.06 U3.4
$1N97: length 2
  Top Layer w0.127: 17.51,32.92 17.58,32.85 17.58,31.78 17.18,31.38 U2.16
$1N110: length 9.8
  Top Layer w0.203: U2.26 13.67,28.07 13.08,28.07 12.69,27.67 12.69,24.68 12.48,24.48 8.16,24.48 7.72,24.92 R10.2
$1N111: length 14.3
  Top Layer w0.152: TP2.1 19.91,14.9 19.91,11.66 18.38,10.13 15.58,10.13 13.03,12.68 U4.32
$1N114: length 8.4
  Top Layer w0.127: v2(7.12,1.47) 7.92,0.66 10.19,0.66 10.97,1.44 10.97,3 11.09,3.13
  Bottom Layer w0.152: JP1.7 7.03,1.55 v2(7.12,1.47)
$1N116: length 2.6
  Top Layer w0.127: U3.10 5.25,18.2 5.76,18.72 5.76,19.53
$1N122: length 3.6
  Top Layer w0.127: U2.19 15.68,32.58 15.48,32.78 15.48,33.26 16.16,33.94 16.51,33.94
$1N130: length 5.5
  Top Layer w0.148: R15.2 5.72,22.95 5.36,23.31 5.36,23.32 4.19,24.49 2.9,24.49 1.79,23.38 1.59,23.38 1.46,23.26
$1N5736: length 10.5
  Top Layer w0.25: J1.10 8.91,35.42 8.91,36.02 10.47,37.58 15.61,37.58 17.2,35.99 R5.2
$1N5738: length 6.1
  Top Layer w0.25: J1.4 11.91,35.42 11.91,36.02 13.07,37.18 15.25,37.18 15.74,36.69 15.74,36.51 R3.2

## Text on the board
Bottom Silkscreen Layer: by K0TX | V0.1 | digirig | mobile
